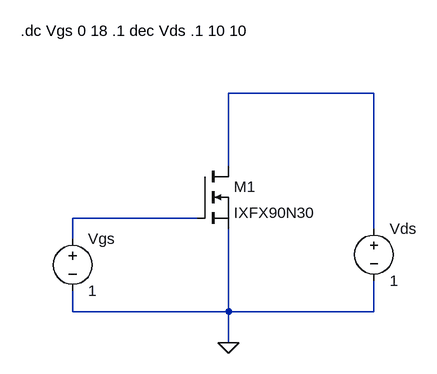
[diagram p0: schematic nMosfet_Curves_Id(Vgs)_Vds.asc]
nMosfet_Curves_Id(Vgs)_Vds.asc, the LTspice schematic file:
Version 4
SHEET 1 880 680
WIRE 480 0 256 0
WIRE 256 112 256 0
WIRE 208 192 16 192
WIRE 480 208 480 0
WIRE 16 224 16 192
WIRE 16 336 16 304
WIRE 256 336 256 208
WIRE 256 336 16 336
WIRE 480 336 480 288
WIRE 480 336 256 336
WIRE 256 384 256 336
FLAG 256 384 0
SYMBOL nmos 208 112 R0
SYMATTR InstName M1
SYMATTR Value IXFX90N30
SYMBOL voltage 16 208 R0
WINDOW 123 0 0 Left 0
WINDOW 39 0 0 Left 0
SYMATTR InstName Vgs
SYMATTR Value 1
SYMBOL voltage 480 192 R0
WINDOW 123 0 0 Left 0
WINDOW 39 0 0 Left 0
SYMATTR InstName Vds
SYMATTR Value 1
TEXT -64 -96 Left 2 !.dc Vgs 0 18 .1 dec Vds .1 10 10

The netlist it stands for:
* nMosfet_Curves_Id(Vgs)_Vds.asc
M1 N001 N002 0 0 IXFX90N30
Vgs N002 0 1
Vds N001 0 1
.model NMOS NMOS
.model PMOS PMOS
.lib standard.mos
.dc Vgs 0 18 .1 dec Vds .1 10 10
.backanno
.end